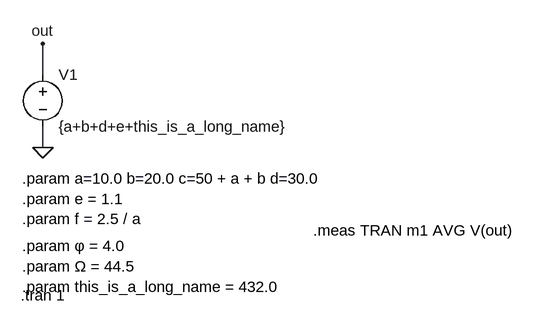
[diagram p0: schematic test14.asc]
test14.asc, the LTspice schematic file:
Version 4
SHEET 1 880 680
WIRE 112 -64 112 -112
WIRE 112 48 112 16
FLAG 112 48 0
FLAG 112 -112 out
SYMBOL voltage 112 -80 R0
SYMATTR InstName V1
SYMATTR Value {a+b+d+e+this_is_a_long_name}
TEXT 80 96 Left 2 !.param a=10.0 b=20.0 c=50 + a + b d=30.0\n.param e = 1.1\n.param f = 2.5 / a
TEXT 80 200 Left 2 !.param φ = 4.0\n.param Ω = 44.5\n.param this_is_a_long_name = 432.0
TEXT 528 176 Left 2 !.meas TRAN m1 AVG V(out)
TEXT 78 276 Left 2 !.tran 1

The netlist it stands for:
* test14.asc
V1 out 0 {a+b+d+e+this_is_a_long_name}
.param a=10.0 b=20.0 c=50 + a + b d=30.0
.param e = 1.1
.param f = 2.5 / a
.param φ = 4.0
.param Ω = 44.5
.param this_is_a_long_name = 432.0
.meas TRAN m1 AVG V(out)
.tran 1
.backanno
.end

* Results of the author's LTspice run, read from the files saved beside the schematic
* From the log:
*   m1: AVG(V(out))=493.100006104 FROM 0 TO 1